# EasyEDA Pro project ProPrj_Analog AI Accelerator_2026-06-26.epro

# Schematic Schematic1
Board Name: Board1; Create Date: 2026-02-14; Page Name: P1; Project Name: Analog AI Accelerator; Schematic Name: Schematic1; Update Date: 2026-03-08; Company: EasyEDA.com; Page Size: A4; Version: V1.0
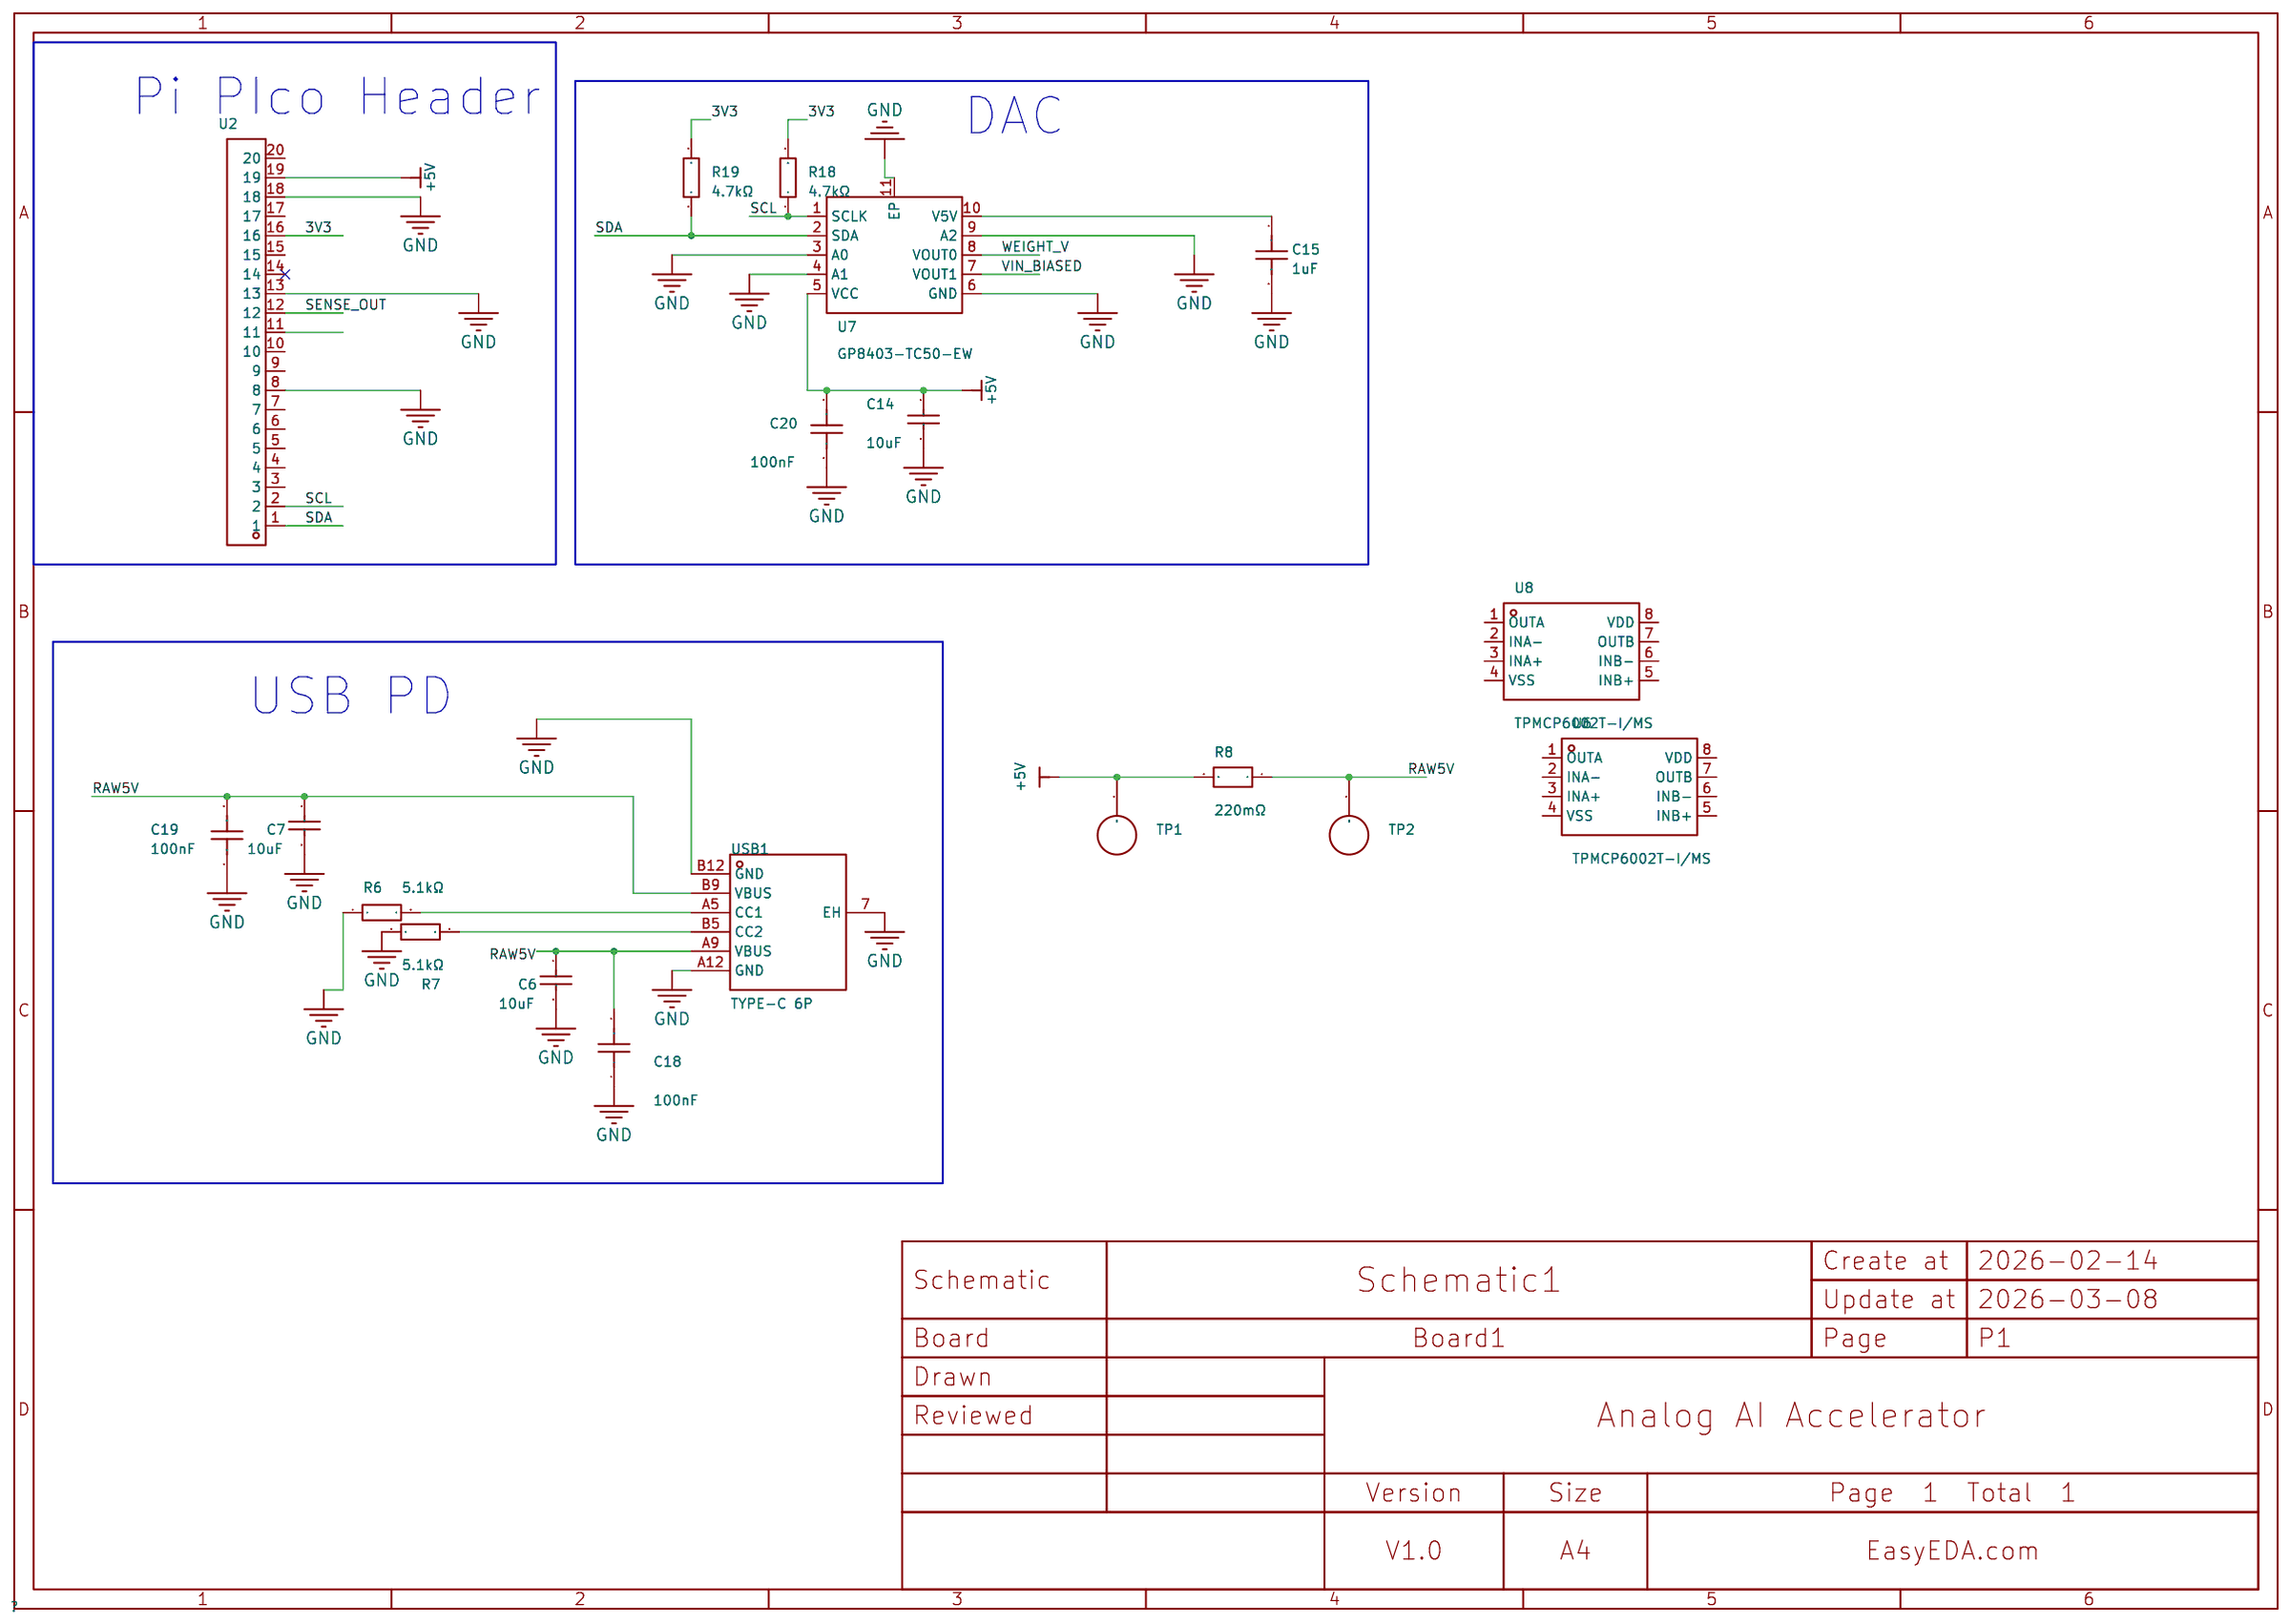
[diagram p0: schematic sheet]

## Parts
C6  10uF  [C1206]
C7  10uF  [C1206]
C14  10uF  [C1206]
C15  1uF  [C1206]
C18  100nF  [C0603]
C19  100nF  [C0603]
C20  100nF  [C0603]
R6  5.1kΩ  [R0603]
R7  5.1kΩ  [R0603]
R8  220mΩ  [RES-SMD_L6.4-W3.2-1]
R18  4.7kΩ  [R0805]
R19  4.7kΩ  [R0805]
TP1  -  [TEST PAD]  (no BOM)
TP2  -  [TEST PAD]  (no BOM)
U2  ZX-PM2.54-1-20PY  [HDR-TH_20P-P2.54-V-F]
U6  TPMCP6002T-I/MS  [MSOP-8_L3.0-W3.0-P0.65-LS4.9-BL]
U7  GP8403-TC50-EW  [ESSOP-10_L4.9-W3.9-P1.00-LS6.0-BL-EP]
U8  TPMCP6002T-I/MS  [MSOP-8_L3.0-W3.0-P0.65-LS4.9-BL]
USB1  TYPE-C 6P  [TYPE-C-SMD_TYPE-C-6P]

## Library data of the parts
C6 C7 C14 = CL31A106KBHNNNE: Capacitance:10uF Tolerance:±10% Tolerance:±10% Voltage Rating:50V Temperature Coefficient:X5R; LCSC Part Name: 10uF ±10% 50V; Supplier Part: C13585; Manufacturer: SAMSUNG(三星); Supplier Footprint: 1206; JLCPCB Part Class: Basic Part; Datasheet: https://item.szlcsc.com/datasheet/CL31A106KBHNNNE/14236.html; Supplier: LCSC; Tolerance: ±10%; Voltage Rating: 50V; Temperature Coefficient: X5R
C15 = CL31B105KBHNNNE: Capacitance:1uF Tolerance:±10% Tolerance:±10% Voltage Rating:50V Temperature Coefficient:X7R; LCSC Part Name: 1uF ±10% 50V; Supplier Part: C1848; Manufacturer: SAMSUNG(三星); Supplier Footprint: 1206; JLCPCB Part Class: Basic Part; Datasheet: https://item.szlcsc.com/datasheet/CL31B105KBHNNNE/2200.html; Supplier: LCSC; Tolerance: ±10%; Voltage Rating: 50V; Temperature Coefficient: X7R
C18-C20 = CC0603KRX7R9BB104: Capacitance:100nF Tolerance:±10% Tolerance:±10% Voltage Rating:50V Temperature Coefficient:X7R; LCSC Part Name: 100nF ±10% 50V; Supplier Part: C14663; Manufacturer: YAGEO(国巨); Supplier Footprint: 0603; JLCPCB Part Class: Basic Part; Datasheet: https://item.szlcsc.com/datasheet/CC0603KRX7R9BB104/15331.html; Supplier: LCSC; Tolerance: ±10%; Voltage Rating: 50V; Temperature Coefficient: X7R
R6 R7 = 0603WAF5101T5E: Type:Thick Film Resistor Resistance:5.1kΩ Tolerance:±1% Tolerance:±1% Power(Watts):100mW Voltage-Supply(Max):75V Temperature Coefficient:±100ppm/℃ Temperature Coefficient:±100ppm/℃ Operating Temperature:-55℃~+155℃ Operating Temperature:-55℃~+155℃; LCSC Part Name: 5.1kΩ ±1% 100mW 厚膜电阻; Supplier Part: C23186; Manufacturer: UNI-ROYAL(厚声); Supplier Footprint: 0603; JLCPCB Part Class: Basic Part; Datasheet: https://item.szlcsc.com/datasheet/0603WAF5101T5E/23913.html; Supplier: LCSC; Type: Thick Film Resistor; Tolerance: ±1%; Power(Watts): 100mW; Voltage-Supply(Max): 75V; Temperature Coefficient: ±100ppm/℃; Operating Temperature: -55℃~+155℃
R8 = HoJLR2512-3W-220mR-1%: Type:Current Sense Resistor Resistance:220mΩ Tolerance:±1% Tolerance:±1% Power(Watts):3W Mounting Type:Surface Mount; LCSC Part Name: 220mΩ ±1% 3W; Supplier Part: C2903478; Manufacturer: Milliohm(毫欧); Supplier Footprint: 2512; JLCPCB Part Class: Extended Part; Datasheet: https://item.szlcsc.com/datasheet/HoJLR2512-3W-220mR-1%2525/3159232.html; Supplier: LCSC; Type: Current Sense Resistor; Tolerance: ±1%; Power(Watts): 3W; Mounting Type: Surface Mount
R18 R19 = 0805W8F4701T5E: Type:Thick Film Resistors Resistance:4.7kΩ Tolerance:±1% Tolerance:±1% Power(Watts): Overload Voltage (Max): Temperature Coefficient:±100ppm/℃ Temperature Coefficient:±100ppm/℃ Operating Temperature Range:-55℃~+155℃ Operating Temperature Range:-55℃~+155℃; LCSC Part Name: 4.7kΩ ±1% 125mW 厚膜电阻; Supplier Part: C17673; Manufacturer: UNI-ROYAL(厚声); Supplier Footprint: 0805; JLCPCB Part Class: Basic Part; Datasheet: https://atta.szlcsc.com/upload/public/pdf/source/20200306/C422600_1E6D84923E4A46A82E41ADD87F860B5C.pdf; Supplier: LCSC; Type: Thick Film Resistors; Tolerance: ±1%; Temperature Coefficient: ±100ppm/℃; Operating Temperature Range: -55℃~+155℃
TP1 TP2 = TEST PAD
U2 = ZX-PM2.54-1-20PY: Holes Structure:1x20P Pitch:2.54mm Row Spacing:- Circular Hole / Square Hole:Square Hole Mounting Type:Through Hole Number of Rows:1 Number of Positions:20P Current Rating:3A Voltage Rating (Max):- Holes Direction:Top Insulation Height:8.5mm Contact Mater; LCSC Part Name: 1x20P 间距:2.54mm 直插; Supplier Part: C7499336; Manufacturer: Megastar(兆星); Supplier Footprint: 插件,P=2.54mm; JLCPCB Part Class: Extended Part; Datasheet: https://item.szlcsc.com/datasheet/ZX-PM2.54-1-20PY/8573997.html; Supplier: LCSC; Holes Structure: 1x20P; Pitch: 2.54mm; Circular Hole / Square Hole: Square Hole; Mounting Type: Through Hole; Number of Rows: 1; Number of Positions: 20P; Current Rating: 3A; Holes Direction: Top; Insulation Height: 8.5mm; Contact Material: Brass; Contact Plating: Gold; Operating Temperature: -40℃~+105℃; PIN Length: 3.2mm
U6 U8 = TPMCP6002T-I/MS: Number of Channels:2 Maximum Power Supply Range (Vdd-Vss):5.5V Rail to Rail:Rail-to-Rail Input, Rail-to-Rail Output Gain Bandwidth Product:1MHz Vos - Input Offset Voltage:5mV Input Offset Voltage Drift(Vos TC):2uV/℃ Slew Rate:600V/ms Ib - Input Bias Curre; LCSC Part Name: 1MHz、低功耗、1.8V、CMOS轨到轨双运算放大器; Supplier Part: C2923373; Manufacturer: TECH PUBLIC(台舟); Supplier Footprint: MSOP-8; JLCPCB Part Class: Extended Part; Datasheet: https://item.szlcsc.com/datasheet/TPMCP6002T-I%252FMS/3234831.html; Supplier: LCSC; Number of Channels: 2; Maximum Power Supply Range (Vdd-Vss): 5.5V; Rail to Rail: Rail-to-Rail Input, Rail-to-Rail Output; Gain Bandwidth Product: 1MHz; Vos - Input Offset Voltage: 5mV; Input Offset Voltage Drift(Vos TC): 2uV/℃; Slew Rate: 600V/ms; Ib - Input Bias Current: 10pA; Input Offset Current(Ios): 10pA; Noise density(eN): 20nV/√Hz@10kHz; Common Mode Rejection Ratio(CMRR): 75dB; Quiescent Current: 110uA; Output Current: 20mA; Operating Temperature: -40℃~+125℃; Single supply: 1.8V~5.5V; Dual Supply: -2.75V~-900mV；900mV~2.75V
U7 = GP8403-TC50-EW: LCSC Part Name: 双路0-10V (0.1%); Supplier Part: C3152007; Manufacturer: Guestgood(客益); Supplier Footprint: ESSOP-10-150mil; JLCPCB Part Class: Extended Part; Datasheet: https://item.szlcsc.com/datasheet/GP8403-TC50-EW/3713796.html; Supplier: LCSC
USB1 = TYPE-C 6P: Connector Type:Type-C Protocol Standard:- Gender:Female Mounting Type:Surface Mount, Right Angle Number of Contacts:6P Number of Ports:1 Current Rating-Power:3A Voltage Rating:5V Connect-Disconnect Life:3,000 Cycles Supplementary Features:- Center Height:; LCSC Part Name: 6P卧贴母座; Supplier Part: C456012; Manufacturer: SHOU HAN(首韩); Supplier Footprint: SMD; JLCPCB Part Class: Extended Part; Datasheet: https://item.szlcsc.com/datasheet/TYPE-C%25206P/458819.html; Supplier: LCSC; Connector Type: Type-C; Gender: Female; Mounting Type: Surface Mount, Right Angle; Number of Contacts: 6P; Number of Ports: 1; Current Rating-Power: 3A; Voltage Rating: 5V; Connect-Disconnect Life: 3,000 Cycles; Detection color: Black; Operating Temperature: -40℃~+85℃

## Nets
3V3: R18.2 R19.2 U2.16
+5V: C14.1 C20.2 R8.2 TP1.1(TEST_PAD1) U2.19 U7.5(VCC)
GND: C6.2 C7.2 C14.2 C15.2 C18.1 C19.1 C20.1 R6.1 R7.1 U2.8 U2.13 U2.18 U7.3(A0) U7.4(A1) U7.6(GND) U7.9(A2) U7.11(EP) USB1.7(EH) USB1.A12(GND) USB1.B12(GND)
VIN_BIASED: U7.7(VOUT1)
RAW5V: C6.1 C7.1 C18.2 C19.2 R8.1 TP2.1(TEST_PAD1) USB1.A9(VBUS) USB1.B9(VBUS)
SCL: R18.1 U2.2 U7.1(SCLK)
SDA: R19.1 U2.1 U7.2(SDA)
SENSE_OUT: U2.12
WEIGHT_V: U7.8(VOUT0)
$1N1637: R6.2 USB1.A5(CC1)
$1N1676: R7.2 USB1.B5(CC2)
$1N10316: C15.1 U7.10(V5V)

Not connected (* = marked no-connect by the designer): U2 3 4 5 6 7 9 10 11 14* 15 17 20; U6 1(OUTA) 2(INA-) 3(INA+) 4(VSS) 5(INB+) 6(INB-) 7(OUTB) 8(VDD); U8 1(OUTA) 2(INA-) 3(INA+) 4(VSS) 5(INB+) 6(INB-) 7(OUTB) 8(VDD)

## Notes on the sheet
- Pi PIco Header
- DAC
- USB PD

# Board PCB1
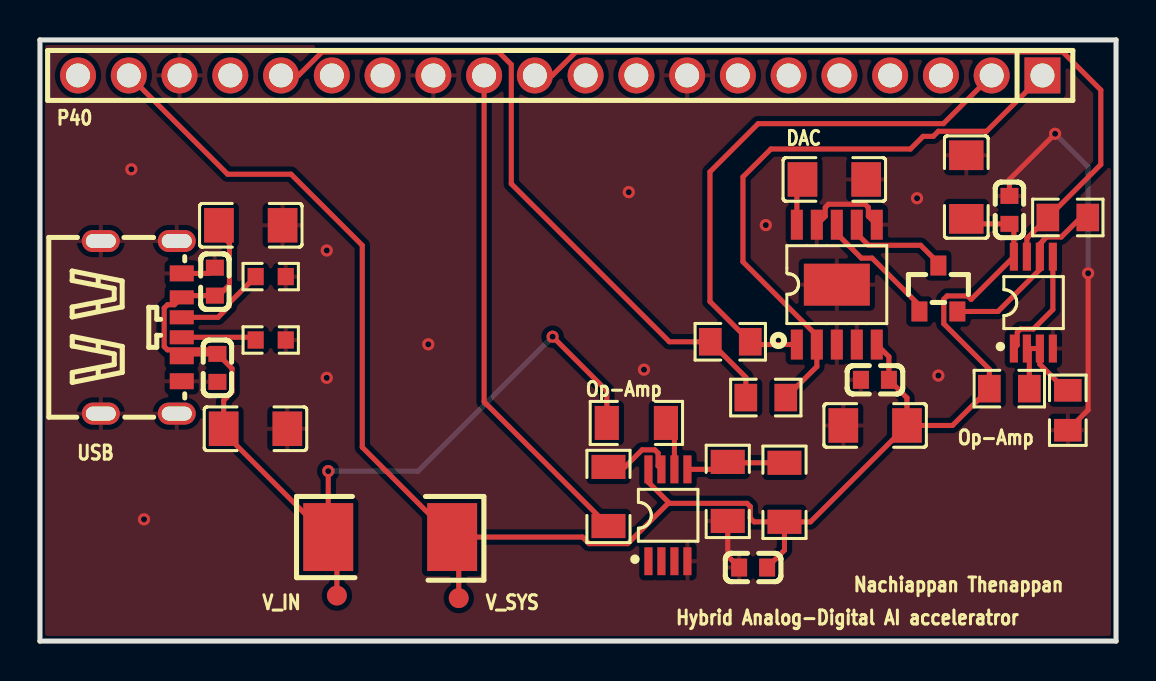
[diagram p1: board, top side]
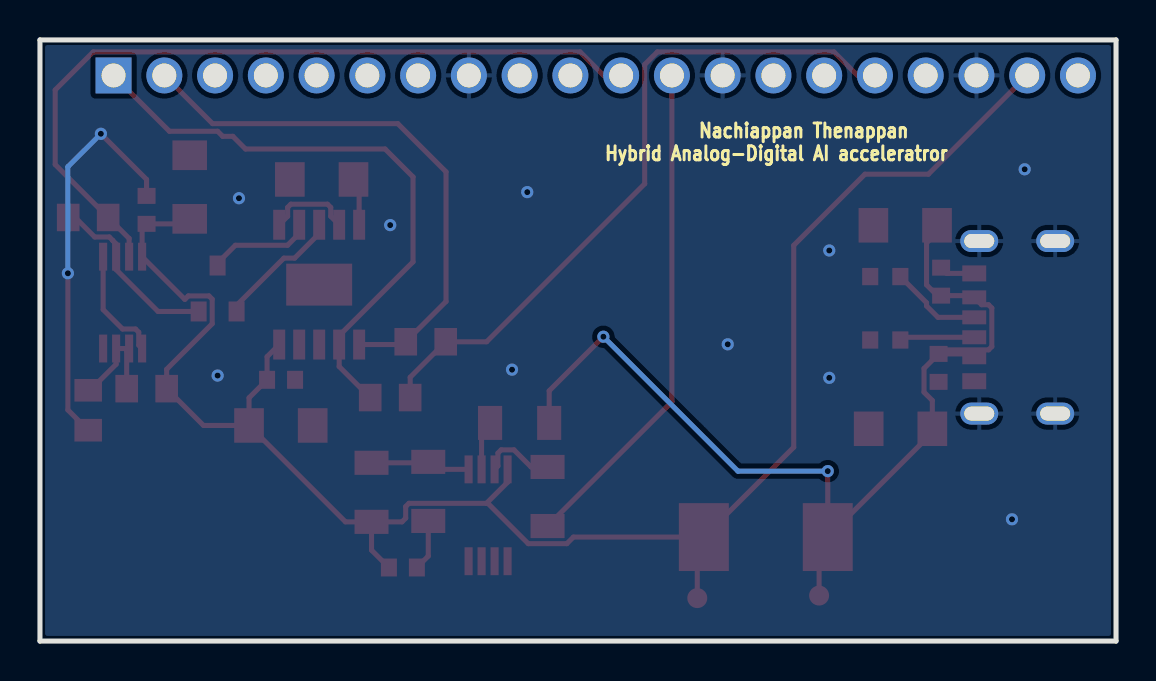
[diagram p2: board, bottom side, seen from below]

Outline 53.85 x 30.1 mm; copper layers: Top Layer, Bottom Layer. Coordinates in mm from the lower left corner of the outline.
Outline path: 0,30.1 0,0 53.85,0 53.85,30.1 0,30.1
Stack: Top Layer 0.035mm / Dielectric1 1.51mm FR4 er 4.5 / Bottom Layer 0.035mm

## Design rules (mm)
spacing copperThickness1oz (default): track to track 0.102, other pairs 0.152 to 0.3
spacing copperThickness2oz: track to track 0.203, other pairs 0.152 to 0.3
spacing Plane_innerPlane: track to track 0.102, other pairs 0.152 to 0.3
spacing Copper_copperRegion: track to track 0.102, other pairs 0.152 to 0.3
track width copperThickness1oz (default): min 0.127, default 0.254, max 2.54
track width copperThickness2oz: min 0.203, default 0.254, max 2.54
differential pair differentialPair (default): width min 0.127, default 0.254, max 2.54; gap min 0.152, default 0.152
pour e194 uses Copper_copperRegion
pour e224 uses Copper_copperRegion

## Placement (name value [footprint] x y rotation side)
C6  10uF  [C1206]  10.55 20.82 0 top
C7  10uF  [C1206]  10.78 10.63 0 top
C8  10uF  [C1206]  46.35 22.73 90 top
C14  10uF  [C1206]  41.79 10.8 180 top
C15  1uF  [C1206]  39.75 23.11 0 top
C16  100nF  [C0603]  48.51 21.59 270 top
C17  100nF  [C0603]  35.69 3.68 0 top
C18  100nF  [C0603]  8.75 18 270 top
C19  100nF  [C0603]  8.88 13.68 90 top
C20  100nF  [C0603]  41.78 13.08 0 top
Q1  L2N7002LT1G  [SOT-23_L2.9-W1.3-P1.90-LS2.4-BR]  44.96 17.65 270 top
R3  10kΩ  [R0805]  48.51 12.64 0 top
R4  10kΩ  [R0805]  51.44 11.56 270 top
R6  5.1kΩ  [R0603]  11.55 18.25 180 top
R7  5.1kΩ  [R0603]  11.55 15.08 180 top
R8  220mΩ  [RES-SMD_L6.4-W3.2-1]  17.53 5.21 0 top
R10  10kΩ  [R0805]  51.44 21.21 180 top
R14  1kΩ  [R1206]  29.84 10.92 0 top
R15  1kΩ  [R1206]  37.26 7.45 90 top
R16  100kΩ  [R1206]  34.42 7.49 90 top
R17  100kΩ  [R1206]  28.45 7.24 90 top
R18  4.7kΩ  [R0805]  34.54 14.99 180 top
R19  4.7kΩ  [R0805]  36.32 12.19 180 top
TP1  -  [TEST PAD]  20.96 2.15 180 top
TP2  -  [TEST PAD]  14.86 2.28 180 top
U2  ZX-PM2.54-1-20PY  [HDR-TH_20P-P2.54-V-F]  26.03 28.32 180 top
U6  TPMCP6002T-I/MS  [MSOP-8_L3.0-W3.0-P0.65-LS4.9-BL]  31.42 6.3 0 top
U7  GP8403-TC50-EW  [ESSOP-10_L4.9-W3.9-P1.00-LS6.0-BL-EP]  39.88 17.85 0 top
U8  TPMCP6002T-I/MS  [MSOP-8_L3.0-W3.0-P0.65-LS4.9-BL]  49.71 16.95 0 top
USB1  TYPE-C 6P  [TYPE-C-SMD_TYPE-C-6P]  5.07 15.71 270 top

## Footprints (pads in the part's own frame, mm; a bottom-side part is the same pattern mirrored in y, then rotated)
C0603
  rect 0.8x0.9 smd: 1(-0.7,0) 2(0.7,0)
C1206
  rect 1.485x1.728 smd: 1(-1.593,0) 2(1.593,0)
ESSOP-10_L4.9-W3.9-P1.00-LS6.0-BL-EP
  rect 0.6x1.5 smd: 1(-2,-3) 2(-1,-3) 3(0,-3) 4(1,-3) 5(2,-3) 6(2,3) 7(1,3) 8(0,3) 9(-1,3) 10(-2,3)
  rect 3.3x2.1 smd: 11(0,0)
HDR-TH_20P-P2.54-V-F
  rect 1.8x1.8 hole 1.2: 1(-24.13,0)
  round 1.8 hole 1.2: 2(-21.59,0) 3(-19.05,0) 4(-16.51,0) 5(-13.97,0) 6(-11.43,0) 7(-8.89,0) 8(-6.35,0) 9(-3.81,0) 10(-1.27,0) 11(1.27,0) 12(3.81,0) 13(6.35,0) 14(8.89,0) 15(11.43,0) 16(13.97,0) 17(16.51,0) 18(19.05,0) 19(21.59,0) 20(24.13,0)
MSOP-8_L3.0-W3.0-P0.65-LS4.9-BL
  rect 0.406x1.397 smd: 1(-0.975,-2.3) 2(-0.325,-2.3) 3(0.325,-2.3) 4(0.975,-2.3) 5(0.975,2.3) 6(0.325,2.3) 7(-0.325,2.3) 8(-0.975,2.3)
R0603
  rect 0.806x0.864 smd: 1(-0.753,0) 2(0.753,0)
R0805
  rect 1.133x1.377 smd: 1(-1,0) 2(1,0)
R1206
  rect 1.208x1.701 smd: 1(-1.479,0) 2(1.479,0)
RES-SMD_L6.4-W3.2-1
  rect 2.5x3.4 smd: 1(-3.1,0) 2(3.1,0)
SOT-23_L2.9-W1.3-P1.90-LS2.4-BR
  rect 1x0.8 smd: 1(1.15,-0.95) 2(1.15,0.95) 3(-1.15,0)
TEST PAD
  round 1 smd: 1(0,0)
TYPE-C-SMD_TYPE-C-6P
  oval 1.1x1.9 hole 0.7x1.5: 7(-4.32,1.775) 7(-4.32,-2.025) 7(4.32,1.775) 7(4.32,-2.025)
  rect 0.7x1.2 smd: A5(-0.5,2.025) A9(1.5,2.025) B5(0.5,2.025) B9(-1.5,2.025)
  rect 0.8x1.2 smd: A12(2.7,2.025) B12(-2.7,2.025)

## Nets
3V3: R18.2 R19.2 U2.16
+5V: C8.1 C14.1 C16.2 C17.2 C20.2 R3.1 R8.2 R15.1 TP1.1 U2.19 U6.8 U7.5 U8.8
GND: C6.2 C7.2 C8.2 C14.2 C15.2 C16.1 C17.1 C18.1 C19.1 C20.1 R4.2 R6.1 R7.1 R16.1 U2.8 U2.13 U2.18 U6.4 U7.3 U7.4 U7.6 U7.9 U7.11 U8.4 USB1.7 USB1.A12 USB1.B12
VIN_BIASED: Q1.3 U7.7
MAC_OUT: R10.2 U2.11 U8.7
RAW5V: C6.1 C7.1 C18.2 C19.2 R8.1 R14.1 TP2.1 USB1.A9 USB1.B9
SCL: R18.1 U2.2 U7.1
SDA: R19.1 U2.1 U7.2
SENSE_OUT: R17.1 U2.12
VREF: U8.1 U8.5
VREF_RAW: R3.2 R4.1 U8.2 U8.3
WEIGHT_V: Q1.1 U7.8
$1N1637: R6.2 USB1.A5
$1N1676: R7.2 USB1.B5
$1N6476: Q1.2 R10.1 U8.6
$1N6668: R15.2 R16.2 U6.5
$1N6831: R17.2 U6.7
$1N7206: R14.2 U6.6
$1N10316: C15.1 U7.10

Pads without a net: U2 3 4 5 6 7 9 10 14 15 17 20; U6 1 2 3

## Via types
v1: diameter 0.61, hole 0.305, Top Layer to Bottom Layer, 14 vias

## Routing (per net, layer and track width the routed paths; a pad name or vN(x,y) marks a point on that pad's centre or on a via; arc(x,y) is an arc through that point)
3V3: length 35
  Top Layer w0.254: U2.16 12.94,28.32 14.12,29.5 22.95,29.5 23.59,28.86 23.59,22.9 31.5,14.99 R18.2 35.32,13.21 R19.2
+5V: length 89.8
  Top Layer w0.254: C14.1 45.66,10.8 R3.1 47.51,13.61 45.23,15.89 45.23,17.12 45.39,17.28 46.42,17.28 46.59,17.12 46.61,17.12 U8.8 48.74,20.67 C16.2 46.61,20.89 C8.1 ; C14.1 38.56,5.97 R15.1 ; C14.1 43.39,12.18 C20.2 42.48,14.24 U7.5 ; R15.1 35.73,5.97 35.55,6.15 35.55,6.73 35.38,6.9 31.5,6.9 ; R15.1 37.26,4.55 C17.2 36.23,3.68 ; R8.2 27.15,5.21 27.48,4.88 29.41,4.88 31.43,6.9 31.5,6.9 ; R8.2 16.13,9.7 16.13,19.81 12.56,23.38 9.39,23.38 4.45,28.32 ; R8.2 20.96,4.88 TP1.1 ; 31.5,6.9 30.45,7.95 U6.8
GND: length 28.7
  Top Layer w0.254: R4.2 52.45,11.57 v1(52.45,18.41) ; C16.1 48.51,23.11 v1(50.8,25.4) ; U7.6 41.45,21.27 41.45,21.71 41.29,21.88 39.46,21.88 39.3,21.71 39.3,21.27 U7.9 ; C18.1 8.47,18.41 7.09,18.41 ; R16.1 34.42,4.25 34.99,3.68
  Bottom Layer w0.254: v1(50.8,25.4) 52.45,23.75 v1(52.45,18.41)
  vias: v1(4.57,23.62) v1(5.21,6.1) v1(14.35,19.56) v1(14.35,13.18) v1(19.43,14.86) v1(29.46,22.48) v1(30.23,13.59) v1(36.32,20.83) v1(43.89,22.17) v1(44.96,13.29)
VIN_BIASED: length 5.3
  Top Layer w0.254: U7.7 40.89,20.83 40.89,20.38 41.46,19.82 44.07,19.82 44.96,18.93 Q1.3
MAC_OUT: length 39.5
  Top Layer w0.254: U8.7 49.39,20.16 R10.2 53.09,23.86 53.09,27.59 51.18,29.5 26.82,29.5 25.64,28.32 24.77,28.32
RAW5V: length 51.2
  Top Layer w0.254: C6.1 8.96,20.46 9.48,19.93 9.48,17.84 8.94,17.3 C18.2 7.18,17.3 6.72,16.84 6.38,16.84 6.22,16.68 6.22,14.74 6.38,14.58 8.68,14.58 C19.2 ; 7.09,14.21 7.26,14.38 C19.2 ; C19.2 9.61,13.65 9.61,12.46 9.19,12.05 C7.1 9.19,10.44 R8.1 ; TP2.1 14.86,4.77 R8.1 ; R8.1 v1(14.43,8.51) ; R14.1 28.37,12.53 v1(25.65,15.24)
  Bottom Layer w0.254: v1(25.65,15.24) 18.92,8.51 v1(14.43,8.51)
SCL: length 27.8
  Top Layer w0.254: U7.1 35.68,14.85 R18.1 33.53,17 33.53,23.5 35.94,25.91 45.21,25.91 U2.2
SDA: length 30.4
  Top Layer w0.254: R19.1 38.88,13.75 U7.2 38.99,14.96 38.99,15.18 35.18,18.99 35.18,23.24 36.58,24.64 43.56,24.64 44.2,25.27 44.7,25.27 44.96,25.53 47.37,25.53 U2.1
SENSE_OUT: length 25.1
  Top Layer w0.254: R17.1 22.22,11.98 U2.12
VREF: length 5.8
  Top Layer w0.254: U8.5 50.69,16.6 49.71,15.62 49.07,15.62 48.9,15.46 48.9,14.81 U8.1
VREF_RAW: length 5.3
  Top Layer w0.254: 51.32,12.57 50.04,13.86 50.04,14.65 U8.2 49.51,14.53 R3.2
WEIGHT_V: length 6.4
  Top Layer w0.254: U7.8 39.88,20.4 41.1,19.17 41.64,19.17 44.01,16.81 Q1.1
$1N1637: length 4.6
  Top Layer w0.254: R6.2 9.48,16.94 9.48,16.78 8.91,16.21 7.09,16.21
$1N1676: length 3.8
  Top Layer w0.254: R7.2 10.66,15.21 7.09,15.21
$1N6476: length 9.2
  Top Layer w0.254: R10.1 52.08,21.21 51.11,20.23 50.38,20.23 50.2,20.06 50.2,20.05 50.04,19.88 50.04,18.6 47.94,16.5 Q1.2
$1N6668: length 5
  Top Layer w0.254: R15.2 34.46,8.93 R16.2 34.04,8.6 U6.5
$1N6831: length 3.8
  Top Layer w0.254: R17.2 29.27,8.72 30.13,9.57 30.77,9.57 30.93,9.41 30.93,8.77 U6.7
$1N7206: length 2.5
  Top Layer w0.254: 31.75,8.6 31.75,10.5 R14.2
$1N10316: length 2.4
  Top Layer w0.254: C15.1 37.88,22.83 U7.10

## Copper pours and planes (outline as drawn; the poured copper is in the pictures)
GND on Top Layer: -0.38,31.62 55.5,31.62 55.5,-2.41 -0.38,-2.41
GND on Bottom Layer: -2.41,31.75 63.75,31.75 63.75,-3.17 -2.41,-3.17

## Text on the board
Bottom Silkscreen Layer: Nachiappan Thenappan | Hybrid Analog-Digital AI acceleratror
Top Silkscreen Layer: P40 | USB | V_IN | V_SYS | Op-Amp | Hybrid Analog-Digital AI acceleratror | DAC | Nachiappan Thenappan
